# Altium schematic sheet Crystal 32MHz.schdoc
size 124 x 101 mm
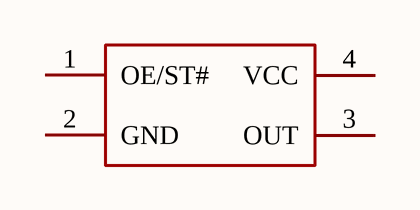
[diagram p0: Crystal 32MHz.schdoc]

## Parts
X?  32MHz  [OSC-SMD_4P-L7.0-W5.0-BL_SG7050]  (value not drawn)

## Nets

Not connected (* = marked no-connect by the designer): X? 1(OE/ST#) 2(GND) 3(OUT) 4(VCC)

## Library data of the parts
X? = X1G0044810009: Manufacturer: EPSON(爱普生); Symbol: X1G004481000900; Add into BOM: yes; Supply Voltage: 1.6V~3.6V; Supply Current (Max): 3mA; Frequency Stability(Full temperature range): ±100ppm; Device: X1G0044810009; LCSC Part Name: X1G0044810009; Supplier Part: C70524; Manufacturer Part: X1G0044810009; Supplier Footprint: SMD7050-4P; JLCPCB Part Class: Extended Part; Datasheet: https://atta.szlcsc.com/upload/public/pdf/source/20161110/1478747518408.pdf; Supplier: LCSC; Convert to PCB: yes; Value: 32MHz; Operating Temperature: -40℃~+85℃